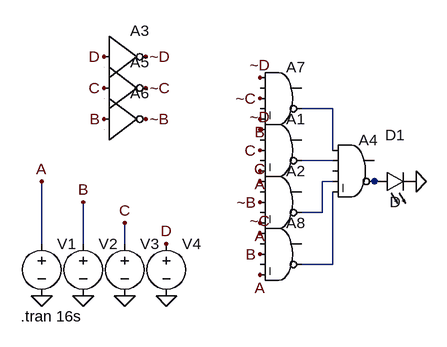
[diagram p0: schematic Draft5.asc]
Draft5.asc, the LTspice schematic file:
Version 4
SHEET 1 880 680
WIRE 208 -112 160 -112
WIRE 208 -48 208 -112
WIRE 208 -32 160 -32
WIRE 208 0 192 0
WIRE 288 0 272 0
WIRE 192 48 192 0
WIRE 192 48 160 48
WIRE -240 96 -240 0
WIRE -176 96 -176 32
WIRE -112 96 -112 64
WIRE 208 128 208 16
WIRE 208 128 160 128
FLAG -240 176 0
FLAG -176 176 0
FLAG -112 176 0
FLAG -48 176 0
FLAG -240 0 A
FLAG -176 32 B
FLAG -112 64 C
FLAG -48 96 D
FLAG 336 0 0
FLAG -144 -192 D
FLAG -144 -144 C
FLAG -144 -96 B
FLAG -80 -192 ~D
FLAG -80 -144 ~C
FLAG -80 -96 ~B
FLAG 96 -160 ~D
FLAG 96 -80 ~D
FLAG 96 -128 ~C
FLAG 96 80 ~C
FLAG 96 32 ~B
FLAG 96 -48 C
FLAG 96 0 C
FLAG 96 -96 B
FLAG 96 112 B
FLAG 96 -16 A
FLAG 96 64 A
FLAG 96 144 A
SYMBOL voltage -240 80 R0
WINDOW 3 24 96 Invisible 2
WINDOW 123 0 0 Left 0
WINDOW 39 0 0 Left 0
SYMATTR Value PULSE(1V 0V 0s 1ns 1ns 1s 2s)
SYMATTR InstName V1
SYMBOL voltage -176 80 R0
WINDOW 3 24 96 Invisible 2
WINDOW 123 0 0 Left 0
WINDOW 39 0 0 Left 0
SYMATTR Value PULSE(1V 0V 0s 1ns 1ns 2s 4s)
SYMATTR InstName V2
SYMBOL voltage -112 80 R0
WINDOW 3 24 96 Invisible 2
WINDOW 123 0 0 Left 0
WINDOW 39 0 0 Left 0
SYMATTR Value PULSE(1V 0V 0s 1ns 1ns 4s 8s)
SYMATTR InstName V3
SYMBOL voltage -48 80 R0
WINDOW 3 24 96 Invisible 2
WINDOW 123 0 0 Left 0
WINDOW 39 0 0 Left 0
SYMATTR Value PULSE(1V 0V 0s 1ns 1ns 8s 16s)
SYMATTR InstName V4
SYMBOL Digital\\and 128 -112 R0
SYMATTR InstName A1
SYMBOL Digital\\and 128 -32 R0
SYMATTR InstName A2
SYMBOL Digital\\and 240 -80 R0
SYMATTR InstName A4
SYMBOL LED 272 16 R270
WINDOW 0 72 32 VTop 2
WINDOW 3 0 32 VBottom 2
SYMATTR InstName D1
SYMBOL Digital\\inv -144 -256 R0
SYMATTR InstName A3
SYMBOL Digital\\inv -144 -208 R0
SYMATTR InstName A5
SYMBOL Digital\\inv -144 -160 R0
SYMATTR InstName A6
SYMBOL Digital\\and 128 -192 R0
SYMATTR InstName A7
SYMBOL Digital\\and 128 48 R0
SYMATTR InstName A8
TEXT -272 208 Left 2 !.tran 16s

The netlist it stands for:
* Draft5.asc
V1 A 0 PULSE(1V 0V 0s 1ns 1ns 1s 2s)
V2 B 0 PULSE(1V 0V 0s 1ns 1ns 2s 4s)
V3 C 0 PULSE(1V 0V 0s 1ns 1ns 4s 8s)
V4 D 0 PULSE(1V 0V 0s 1ns 1ns 8s 16s)
A1 ~D 0 C 0 A N002 0 0 AND
A2 C 0 ~B 0 A N003 0 0 AND
A4 N001 N002 0 N003 N005 N004 0 0 AND
D1 N004 0 D
A3 D 0 0 0 0 ~D 0 0 BUF
A5 C 0 0 0 0 ~C 0 0 BUF
A6 B 0 0 0 0 ~B 0 0 BUF
A7 ~D 0 ~C 0 B N001 0 0 AND
A8 ~C 0 B 0 A N005 0 0 AND
.model D D
.lib standard.dio
.tran 16s
.backanno
.end